# Altium project MiniSimpleFoc.PrjPcb
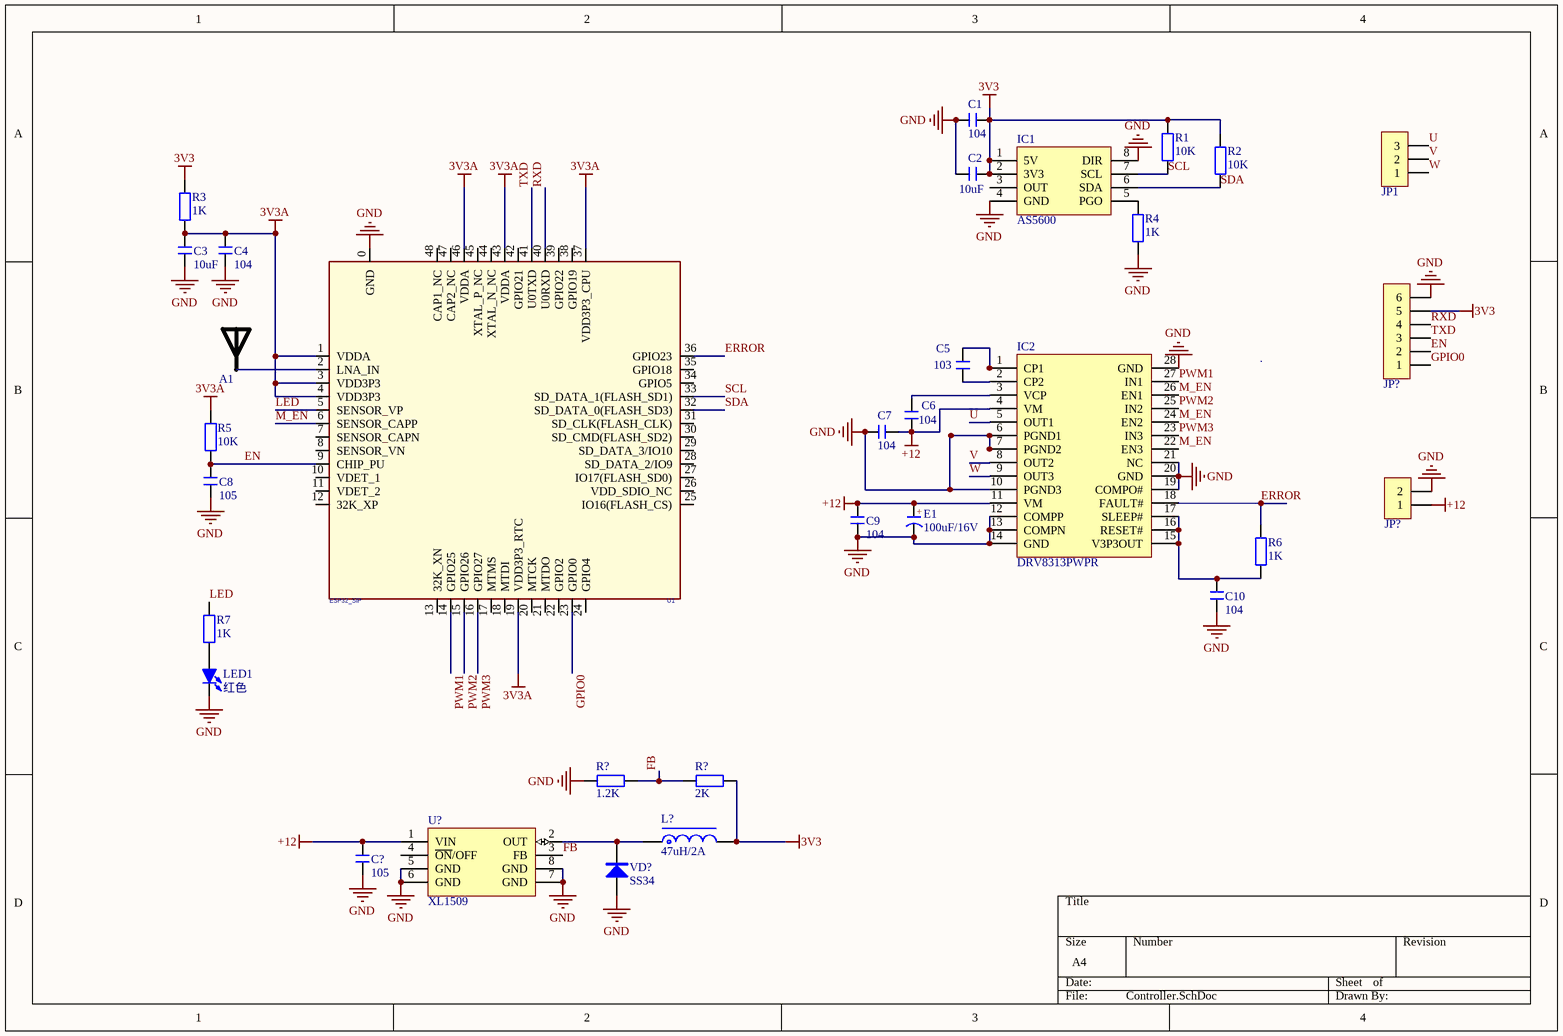
[diagram p0: Controller.SchDoc]
1 sheet, 32 parts. Net scope: global (net labels, ports and power ports of the same name join across sheets).
Board file: Controller.PcbDoc

## Sheet Controller.SchDoc
size A4

### Parts
(Parts that share a designator on the sheet are numbered #1, #2 ... from top to bottom, then left to right.)
A1  RAINSUN  [ANT-Rainsun-AN5120]  (value not drawn)
C1  104  [C 0603]
C2  10uF  [C 0603]
C3  10uF  [C 0603]
C4  104  [C 0603]
C5  103  [C 0603]
C6  104  [C 0603]
C7  104  [C 0603]
C8  105  [C 0603]
C9  104  [C 0603]
C10  104  [C 0603]
C?  105  [C 0603]
E1  100uF/16V  [CD C(6032)]
IC1  AS5600  [SOP8_N]
IC2  DRV8313PWPR  [TSSOP28_L]
JP1  HDR-1X3  [HDR2.54-LI-3P]  (value not drawn)
JP?#1  HDR-1X6  [PH2.0-WS-6P]  (value not drawn)
JP?#2  HDR-1X2  [PH2.0-WS-2P]  (value not drawn)
L?  47uH/2A  [CD32]
LED1  红色  [LED 0603W]
R1  10K  [R 0603]
R2  10K  [R 0603]
R3  1K  [R 0603]
R4  1K  [R 0603]
R5  10K  [R 0603]
R6  1K  [R 0603]
R7  1K  [R 0603]
R?#1  1.2K  [R 0603]
R?#2  2K  [R 0603]
U1  ESP32_SIP  [QFN-48_7X7]
U?  XL1509  [SOP8_L]
VD?  SS34  [SMC]

### Nets
3V3: C1.2 C2.2 IC1.1(5V) IC1.2(3V3) JP?#1.5 L?.2 R1.2 R2.2 R3.2 R?#2.2
3V3A: C3.2 C4.2 R3.1 R5.2 U1.1(VDDA) U1.3(VDD3P3) U1.4(VDD3P3) U1.19(VDD3P3_RTC) U1.37(VDD3P3_CPU) U1.43(VDDA) U1.46(VDDA)
+12: C6.1 C7.2 C9.2 C?.2 E1.1(A) IC2.4(VM) IC2.11(VM) JP?#2.1 U?.1(VIN)
GND: C1.1 C2.1 C3.1 C4.1 C7.1 C8.1 C9.1 C10.1 C?.1 E1.2(K) IC1.4(GND) IC1.8(DIR) IC2.6(PGND1) IC2.7(PGND2) IC2.10(PGND3) IC2.12(COMPP) IC2.13(COMPN) IC2.14(GND) IC2.19(COMPO#) IC2.20(GND) IC2.21(NC) IC2.28(GND) JP?#1.6 JP?#2.2 LED1.2(K) R4.1 R?#1.1 U1.0(GND) U?.5(GND) U?.6(GND) U?.7(GND) U?.8(GND) VD?.1(A)
EN: C8.2 JP?#1.2 R5.1 U1.9(CHIP_PU)
ERROR: IC2.18(FAULT#) R6.1 U1.36(GPIO23)
FB: R?#1.2 R?#2.1 U?.3(FB)
GPIO0: JP?#1.1 U1.23(GPIO0)
LED: R7.2 U1.5(SENSOR_VP)
M_EN: IC2.22(EN3) IC2.24(EN2) IC2.26(EN1) U1.6(SENSOR_CAPP)
PWM1: IC2.27(IN1) U1.14(GPIO25)
PWM2: IC2.25(IN2) U1.15(GPIO26)
PWM3: IC2.23(IN3) U1.16(GPIO27)
RXD: JP?#1.4 U1.40(U0RXD)
SCL: IC1.7(SCL) R1.1 U1.33(SD_DATA_1(FLASH_SD1))
SDA: IC1.6(SDA) R2.1 U1.32(SD_DATA_0(FLASH_SD3))
TXD: JP?#1.3 U1.41(U0TXD)
U: IC2.5(OUT1) JP1.3
V: IC2.8(OUT2) JP1.2
W: IC2.9(OUT3) JP1.1
NetA1_1: A1.1 U1.2(LNA_IN)
NetC5_1: C5.1 IC2.2(CP2)
NetC5_2: C5.2 IC2.1(CP1)
NetC6_2: C6.2 IC2.3(VCP)
NetC10_2: C10.2 IC2.15(V3P3OUT) IC2.16(RESET#) IC2.17(SLEEP#) R6.2
NetIC1_5: IC1.5(PGO) R4.2
NetL?_1: L?.1 U?.2(OUT) VD?.2(K)
NetLED1_1: LED1.1(A) R7.1

Not connected (* = marked no-connect by the designer): IC1 3(OUT); U1 7(SENSOR_CAPN) 8(SENSOR_VN) 10(VDET_1) 11(VDET_2) 12(32K_XP) 13(32K_XN) 17(MTMS) 18(MTDI) 20(MTCK) 21(MTDO) 22(GPIO2) 24(GPIO4) 25(IO16(FLASH_CS)) 26(VDD_SDIO_NC) 27(IO17(FLASH_SD0)) 28(SD_DATA_2/IO9) 29(SD_DATA_3/IO10) 30(SD_CMD(FLASH_SD2)) 31(SD_CLK(FLASH_CLK)) 34(GPIO5) 35(GPIO18) 38(GPIO19) 39(GPIO22) 42(GPIO21) 44(XTAL_N_NC) 45(XTAL_P_NC) 47(CAP2_NC) 48(CAP1_NC); U? 4(~{ON}/OFF)

### Notes on the sheet
- (in symbol C-CD) +

### Library data of the parts
A1 = ANT-Rainsun-AP5120
C1-C10 C? = C: 无极性贴片电容; 版权归属: 源创客; BOM名称: 无极性贴片电容; 学习资源: www.ooocke.com
E1 = C-CD: 贴片钽电容; BOM名称: 贴片钽电容
IC1 = AS5600: 磁编码器; BOM名称: CAN芯片
IC2 = DRV8313PWPR: 无刷电机驱动; BOM名称: 串口转USB
JP1 = Header 3: 3P接插件; 版权归属: 源创客; BOM名称: 3P接插件; 学习资源: www.ooocke.com
JP?#1 = Header 6: 6P接插件; BOM名称: 6P接插件
JP?#2 = Header 2: 2P接插件; BOM名称: 2P接插件
L? = L-CD: 贴片功率电感; BOM名称: 功率电感
LED1 = LED-SMD: 贴片LED; BOM名称: 贴片LED
R1-R7 R?#1 R?#2 = R: 贴片电阻; 版权归属: 源创客; BOM名称: 贴片电阻; 学习资源: www.ooocke.com
U1 = ESP32-PICO
U? = XL1509: DC降电压芯片; 描述: 降压，40V/2A/150KHz; 参数: IN:40,OUT:1.25-37/2A,150KHz; BOM名称: DC降电压芯片
VD? = SS34: 肖特基二极管; 版权归属: 源创客; 属性: 40V/3A; BOM名称: 肖特基二极管; 学习资源: www.ooocke.com